# EAGLE design maplemini (EAGLE 9.2.2)
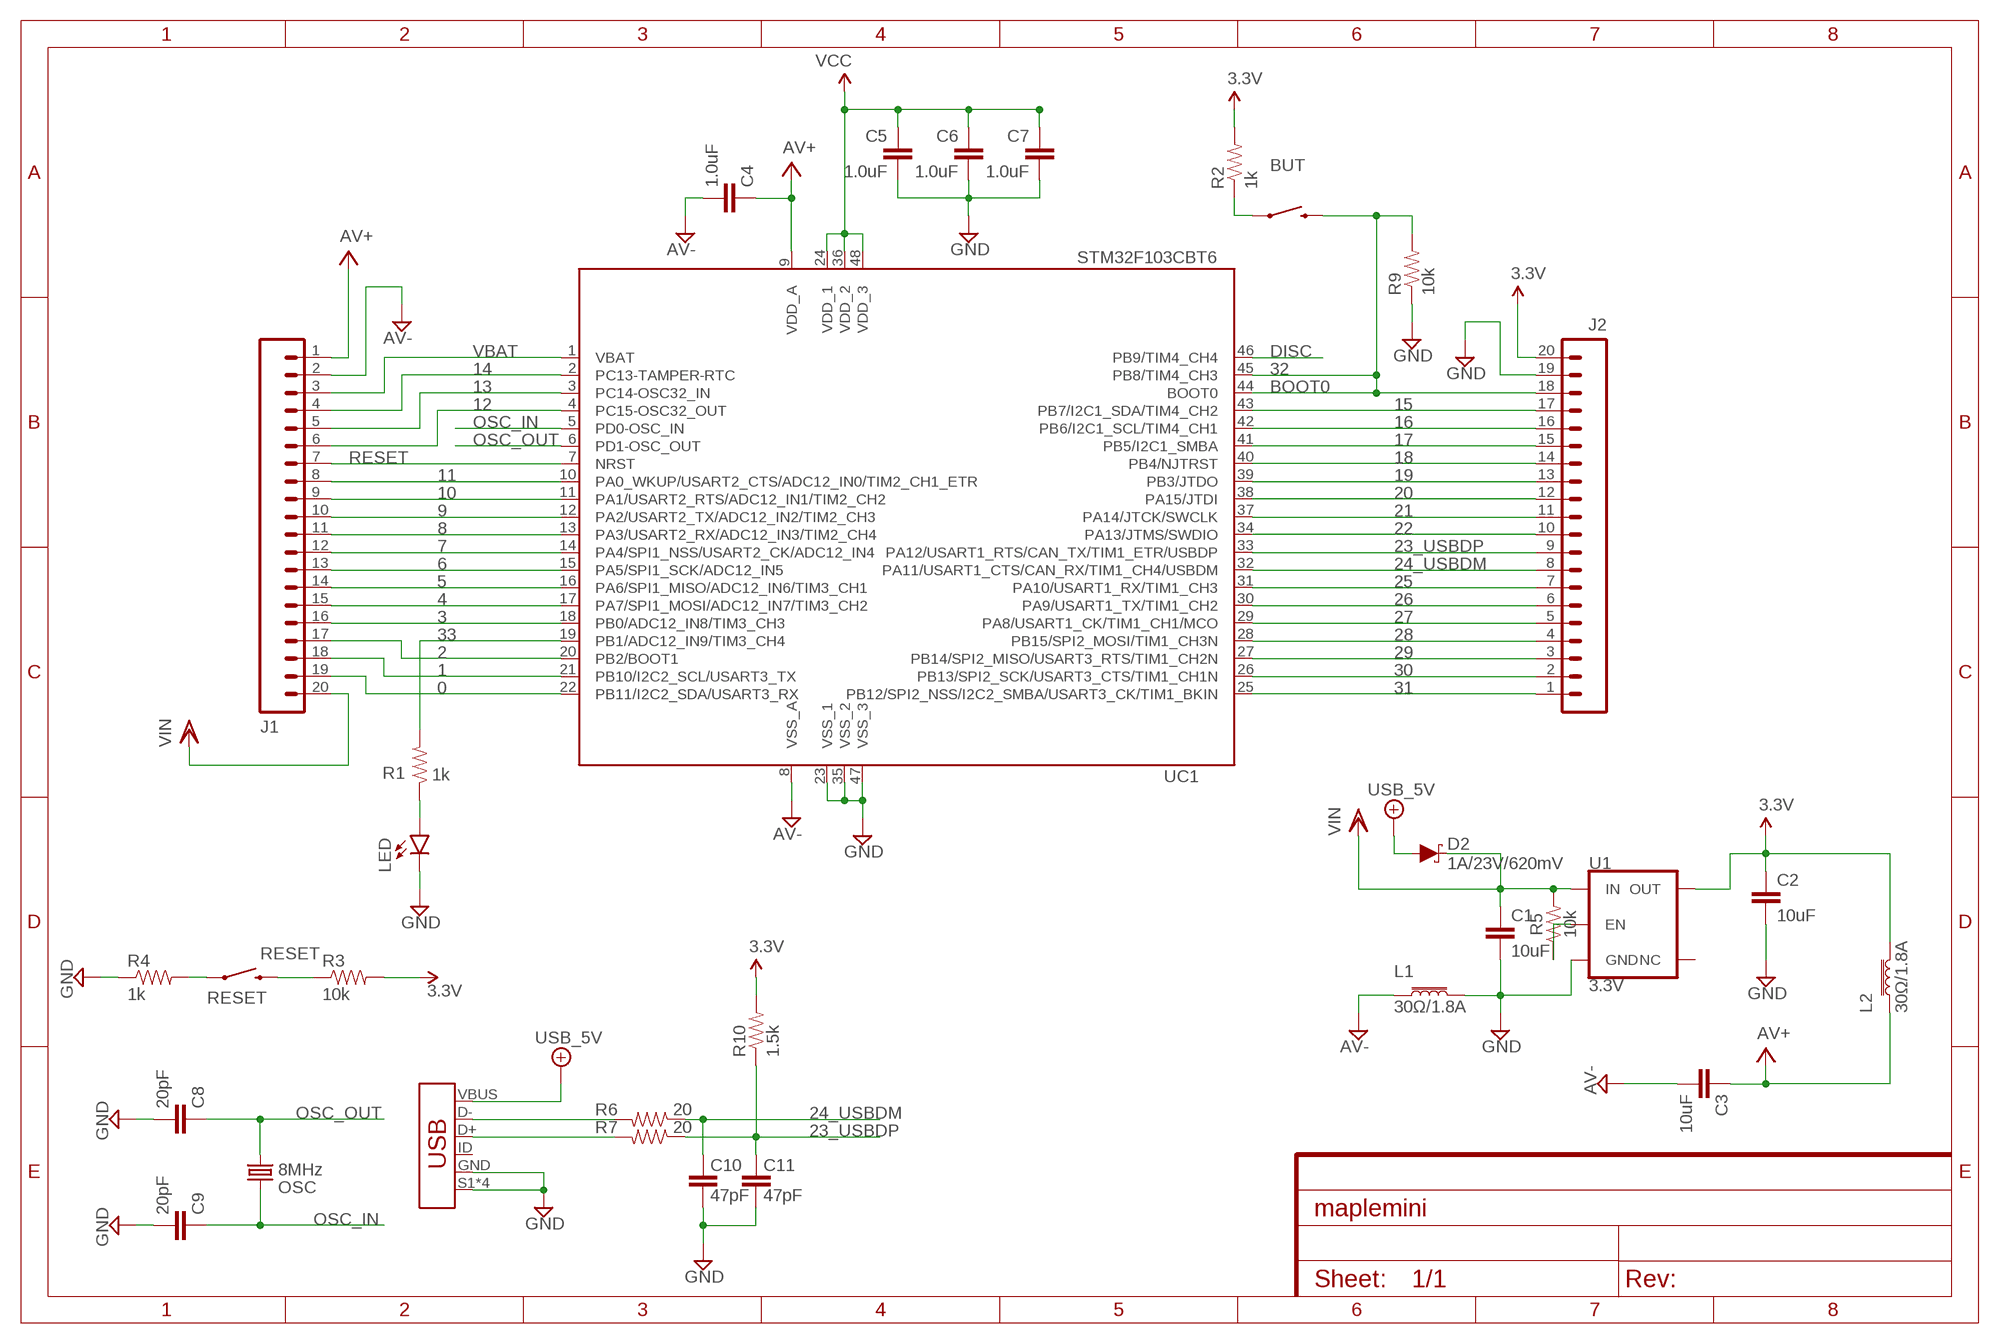
[diagram p0: schematic, sheet 1]

## Parts
BUT  KMR211GLFS  34-MOMENTARY-SWITCH  [3*4-MOMENTARY-SWITCH]
C1  10uF  10UF-0603-6.3V-20%  [0603]
C2  10uF  10UF-0603-6.3V-20%  [0603]
C3  10uF  10UF-0603-6.3V-20%  [0603]
C4  1.0uF  1.0UF-0603-16V-10%-X7R  [0603]
C5  1.0uF  1.0UF-0603-16V-10%-X7R  [0603]
C6  1.0uF  1.0UF-0603-16V-10%-X7R  [0603]
C7  1.0uF  1.0UF-0603-16V-10%-X7R  [0603]
C8  20pF  22PF-0603-50V-5%  [0603]
C9  20pF  22PF-0603-50V-5%  [0603]
C10  47pF  47PF-0603-50V-5%  [0603]
C11  47pF  47PF-0603-50V-5%  [0603]
D2  1A/23V/620mV  DIODE-SCHOTTKY-BAT20J  [SOD-323]
J1  CONN_20LOCK  [1X20_LOCK]
J2  CONN_20LOCK  [1X20_LOCK]
L1  30Ω/1.8A  FERRITE_BEAD-0603  [0603]
L2  30Ω/1.8A  FERRITE_BEAD-0603  [0603]
LED  RED  LED-RED1206  [LED-1206]
OSC  8MHz  CRYSTALSMD-5X3.2-2PAD  [CRYSTAL-SMD-5X3.2-2PAD]
R1  1k  1KOHM-0603-1/10W-1%  [0603]
R2  1k  1KOHM-0603-1/10W-1%  [0603]
R3  10k  10KOHM-0603-1/10W-1%  [0603]
R4  1k  1KOHM-0603-1/10W-1%  [0603]
R5  10k  10KOHM-0603-1/10W-1%  [0603]
R6  20  20OHM-0603-1/10W-1%  [0603]
R7  20  20OHM-0603-1/10W-1%  [0603]
R9  10k  10KOHM-0603-1/10W-1%  [0603]
R10  1.5k  1.5KOHM-0603-1/10W-1%  [0603]
RESET  KMR211GLFS  34-MOMENTARY-SWITCH  [3*4-MOMENTARY-SWITCH]
U1  3.3V  V_REG_AP2112K-3.3V  [SOT23-5]
UC1  STM32F103CBT6  STM32F103CB  [LQFP48]
X1  USB-MINIB  USB_MINI-B_SMT  [USB-MINIB]

## Nets
0: J1.19 UC1.22(PB11/I2C2_SDA/USART3_RX)
1: J1.18 UC1.21(PB10/I2C2_SCL/USART3_TX)
2: J1.17 UC1.20(PB2/BOOT1)
3: J1.16 UC1.18(PB0/ADC12_IN8/TIM3_CH3)
4: J1.15 UC1.17(PA7/SPI1_MOSI/ADC12_IN7/TIM3_CH2)
5: J1.14 UC1.16(PA6/SPI1_MISO/ADC12_IN6/TIM3_CH1)
6: J1.13 UC1.15(PA5/SPI1_SCK/ADC12_IN5)
7: J1.12 UC1.14(PA4/SPI1_NSS/USART2_CK/ADC12_IN4)
8: J1.11 UC1.13(PA3/USART2_RX/ADC12_IN3/TIM2_CH4)
9: J1.10 UC1.12(PA2/USART2_TX/ADC12_IN2/TIM2_CH3)
10: J1.9 UC1.11(PA1/USART2_RTS/ADC12_IN1/TIM2_CH2)
11: J1.8 UC1.10(PA0_WKUP/USART2_CTS/ADC12_IN0/TIM2_CH1_ETR)
12: J1.6 UC1.4(PC15-OSC32_OUT)
13: J1.5 UC1.3(PC14-OSC32_IN)
14: J1.4 UC1.2(PC13-TAMPER-RTC)
15: J2.17 UC1.43(PB7/I2C1_SDA/TIM4_CH2)
16: J2.16 UC1.42(PB6/I2C1_SCL/TIM4_CH1)
17: J2.15 UC1.41(PB5/I2C1_SMBA)
18: J2.14 UC1.40(PB4/NJTRST)
19: J2.13 UC1.39(PB3/JTDO)
20: J2.12 UC1.38(PA15/JTDI)
21: J2.11 UC1.37(PA14/JTCK/SWCLK)
22: J2.10 UC1.34(PA13/JTMS/SWDIO)
23_USBDP: C11.2 J2.9 R7.1 R10.1 UC1.33(PA12/USART1_RTS/CAN_TX/TIM1_ETR/USBDP)
24_USBDM: C10.2 J2.8 R6.1 UC1.32(PA11/USART1_CTS/CAN_RX/TIM1_CH4/USBDM)
25: J2.7 UC1.31(PA10/USART1_RX/TIM1_CH3)
26: J2.6 UC1.30(PA9/USART1_TX/TIM1_CH2)
27: J2.5 UC1.29(PA8/USART1_CK/TIM1_CH1/MCO)
28: J2.4 UC1.28(PB15/SPI2_MOSI/TIM1_CH3N)
29: J2.3 UC1.27(PB14/SPI2_MISO/USART3_RTS/TIM1_CH2N)
30: J2.2 UC1.26(PB13/SPI2_SCK/USART3_CTS/TIM1_CH1N)
31: J2.1 UC1.25(PB12/SPI2_NSS/I2C2_SMBA/USART3_CK/TIM1_BKIN)
32: BUT.P2 J2.18 R9.2 UC1.44(BOOT0) UC1.45(PB8/TIM4_CH3)
33: R1.2 UC1.19(PB1/ADC12_IN9/TIM3_CH4)
+5V/2: D2.A X1.VBUS ; supply symbol labelled USB_5V
AV+: C3.1 C4.1 J1.1 L2.1 UC1.9(VDD_A)
AV-: C3.2 C4.2 J1.2 L1.1 UC1.8(VSS_A)
DGND: C1.2 C2.2 C5.2 C6.2 C7.2 C8.2 C9.2 C10.1 C11.1 J2.19 L1.2 LED.C R4.1 R9.1 U1.2(GND) UC1.23(VSS_1) UC1.35(VSS_2) UC1.47(VSS_3) X1.GND X1.S1(SHIELD) X1.S2(SHIELD) X1.S3(SHIELD) X1.S4(SHIELD) ; supply symbol labelled GND
DISC: UC1.46(PB9/TIM4_CH4)
N$1: BUT.P1 R2.1
N$2: LED.A R1.1
N$3: R5.1 U1.3(EN)
N$4: R4.2 RESET.P1
N$59: R6.2 X1.D-
N$60: R7.2 X1.D+
OSC_IN: C9.1 OSC.P$2 UC1.5(PD0-OSC_IN)
OSC_OUT: C8.1 OSC.P$1 UC1.6(PD1-OSC_OUT)
RESET: J1.7 R3.1 RESET.P2 UC1.7(NRST)
VBAT: J1.3 UC1.1(VBAT)
VCC: C2.1 C5.1 C6.1 C7.1 J2.20 L2.2 R2.2 R3.2 R10.2 U1.5(OUT) UC1.24(VDD_1) UC1.36(VDD_2) UC1.48(VDD_3) ; supply symbol labelled 3.3V
VIN: C1.1 D2.C J1.20 R5.2 U1.1(IN)
Unconnected: U1.4(NC) X1.ID

## Notes on the sheet
- BOOT0

## Library data of the parts
BUT RESET = JH:3*4-MOMENTARY-SWITCH
C1-C3 = SparkFun-Capacitors:10UF: 10.0µF ceramic capacitors A capacitor is a passive two-terminal electrical component used to store electrical energy temporarily in an electric field.; PROD_ID: CAP-11015
C4-C7 = SparkFun-Capacitors:1.0UF: 1µF ceramic capacitors A capacitor is a passive two-terminal electrical component used to store electrical energy temporarily in an electric field.; PROD_ID: CAP-13930
C8 C9 = SparkFun-Capacitors:22PF: 22pF ceramic capacitors A capacitor is a passive two-terminal electrical component used to store electrical energy temporarily in an electric field.; PROD_ID: CAP-07876; VALUE: 22pF
C10 C11 = SparkFun-Capacitors:47PF: 47pF ceramic capacitors A capacitor is a passive two-terminal electrical component used to store electrical energy temporarily in an electric field.; PROD_ID: CAP-08913
D2 = SparkFun-DiscreteSemi:DIODE-SCHOTTKY: Schottky diode A Schottky diode is a semiconductor diode which has a low forward voltage drop and a very fast switching action.; PROD_ID: DIO-11623
J1 J2 = SparkFun-Connectors:CONN_20: Multi connection point. Often used as Generic Header-pin footprint for 0.1 inch spaced/style header connections On any of the 0.1 inch spaced packages, you can populate with these: Break Away Headers - Straight <https://www.sparkfun.com/products/116> (PRT-00116) Break Away Male Headers - Right Angle <https://www.sparkfun.com/products/553> (PRT-00553) Female Headers <https://www.sparkfun.com/products/115> (PRT-00115) Break Away Headers - Machine Pin <https://www.sparkfun.com/products/117> (PRT-00117) Break Away Female Headers - Swiss Machine Pin <https://www.sparkfun.com/products/743> (PRT-00743) For SCREWTERMINALS and SPRING TERMINALS visit here: Screw Terimnals on SparkFun.com <https://www.sparkfun.com/search/results?term=Screw+Terminals> (5mm/3.5mm/2.54mm spacing) This device is also useful as a general connection point to wire up your design to another part of your project. Our various solder wires solder well into these plated through hole pads. Hook-Up Wire - Assortment (Stranded, 22 AWG) <https://www.sparkfun.com/products/11375> (PRT-11375) Hook-Up Wire - Assortment (Solid Core, 22 AWG) <https://www.sparkfun.com/products/11367> (PRT-11367) View the entire wire category on our website here <https://www.sparkfun.com/categories/141> Special notes: Molex polarized connector foot print use with SKU : PRT-08231 with associated crimp pins and housings. 1MM SMD Version SKU: PRT-10208 NOTES ON THE VARIANTS LOCK and LOCK_LONGPADS... This footprint was designed to help hold the alignment of a through-hole component (i.e. 6-pin header) while soldering it into place. You may notice that each hole has been shifted either up or down by 0.005 of an inch from it's more standard position (which is a perfectly straight line). This slight alteration caused the pins (the squares in the middle) to touch the edges of the holes. Because they are alternating, it causes a "brace" to hold the component in place. 0.005 has proven to be the perfect amount of "off-center" position when using our standard breakaway headers. Although looks a little odd when you look at the bare footprint, once you have a header in there, the alteration is very hard to notice. Also,if you push a header all the way into place, it is covered up entirely on the bottom side. Note about LOCK SPECIAL package: This is just like the LOCK variant in that the holes are staggared by 5 mil, but except for the last two holes. They are not altered from the "standard" footprint layout. This is used for a special purpose on the layout of our Graphic LCD Backpack. Make sure you want to use this device before selecting it for you project!
L1 L2 = SparkFun-Coils:FERRITE_BEAD: Ferrite Bead (blocks, cores, rings, chokes, etc.) Inductor with layers of ferrite used to suppress high frequencies. Often used to isolate high frequency noise. SparkFun Products: IOIO-OTG - V2.2 <https://www.sparkfun.com/products/13613> SparkFun SAMD21 Mini Breakout <https://www.sparkfun.com/products/13664> SparkFun 6 Degrees of Freedom Breakout - LSM6DS3 <https://www.sparkfun.com/products/13339> SparkFun SAMD21 Dev Breakout <https://www.sparkfun.com/products/13672>; PROD_ID: NDUC-13805
LED = SparkFun-LED:LED-RED: Red SMD LED Used in manufacturing of most products at SparkFun Packages: 0603 - SMD 0603 package [Product Link] <http://docs.avagotech.com/docs/AV02-0551EN> 0603 SMART - SMD 0603 SMART package ( more efficient and expensive)[Product Link] <http://www.osram-os.com/Graphics/XPic2/00077099_0.pdf> 1206 - SMD1206 package [Product Link] <https://www.sparkfun.com/datasheets/DevTools/LilyPad/Q150OVS4.pdff> SparkFun Products: Pro Mini 328 -5V <https://www.sparkfun.com/products/821> RedBoard <https://www.sparkfun.com/products/12757> IOIO-OTG <https://www.sparkfun.com/products/13613>; PROD_ID: DIO-09912
OSC = SparkFun-Clocks:CRYSTAL: Crystals (Generic) These are passive quartz crystals, which can be used as a clock source for a microcontroller. Crystal's are two-terminal devices. They require external "load" capacitors to generate an oscillating signal.
R1 R2 R4 = SparkFun-Resistors:1KOHM: 1kΩ resistor A resistor is a passive two-terminal electrical component that implements electrical resistance as a circuit element. Resistors act to reduce current flow, and, at the same time, act to lower voltage levels within circuits. - Wikipedia; PROD_ID: RES-07856
R3 R5 R9 = SparkFun-Resistors:10KOHM: 10kΩ resistor A resistor is a passive two-terminal electrical component that implements electrical resistance as a circuit element. Resistors act to reduce current flow, and, at the same time, act to lower voltage levels within circuits. - Wikipedia; PROD_ID: RES-00824
R6 R7 = SparkFun-Resistors:20OHM: RES-07862; PROD_ID: RES-07862
R10 = SparkFun-Resistors:1.5KOHM: 1.5kΩ resistor A resistor is a passive two-terminal electrical component that implements electrical resistance as a circuit element. Resistors act to reduce current flow, and, at the same time, act to lower voltage levels within circuits. - Wikipedia; PROD_ID: RES-08306
U1 = SparkFun-IC-Power:V_REG_AP2112: AP2112 - 600mA CMOS LDO Regulator w/ Enable The AP2112 is CMOS process low dropout linear regulator with enable function, the regulator delivers a guaranteed 600mA (min.) continuous load current. Features Output Voltage Accuracy: ±1.5% Output Current: 600mA (Min.) Foldback Short Current Protection: 50mA Enable Function to Turn ON/OFF VOUT Low Dropout Voltage (3.3V): 250mV (Typ.) @IOUT=600mA Excellent Load Regulation: 0.2%/A (Typ.) Excellent Line Regulation: 0.02%/V (Typ.) Low Quiescent Current: 55μA (Typ.) Low Standby Current: 0.01μA (Typ.) Low Output Noise: 50μVRMS PSRR: 100Hz -65dB, 1kHz -65dB OTSD Protection Stable with 1.0μF Flexible Cap: Ceramic, Tantalum and Aluminum Electrolytic Operation Temperature Range: -40°C to 85°C ESD: MM 400V, HBM 4000V; PROD_ID: VREG-12457
UC1 = stm32:STM32F103CB
X1 = SparkFun-Connectors:USB_MINI-B: USB type Mini-B Connector Breaks out 5th pin, and includes shield pins if needed. SparkFun Products: SparkFun FTDI Basic Breakout <https://www.sparkfun.com/products/9716> SparkFun XBee Explorer USB <https://www.sparkfun.com/products/11812> SparkFun Redboard <https://www.sparkfun.com/products/12757>; PROD_ID: CONN-08193; SF_ID: PRT-00587

## Net classes
1 vcc: width 0.254 mm

## Board
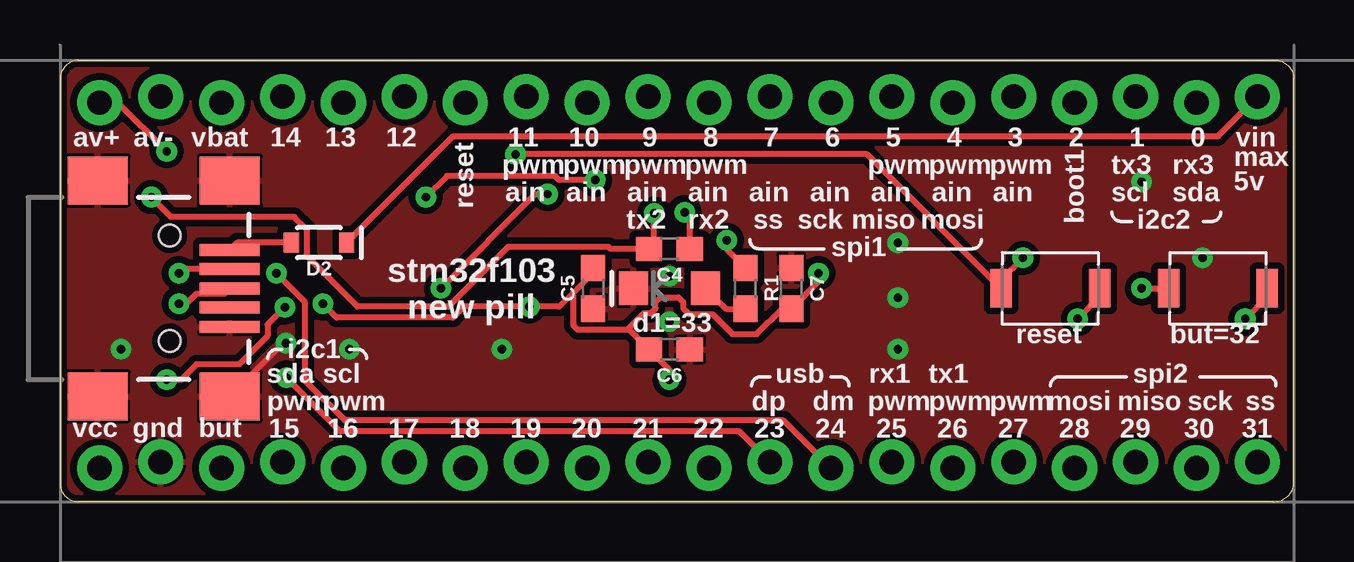
[diagram p1: board, top side]
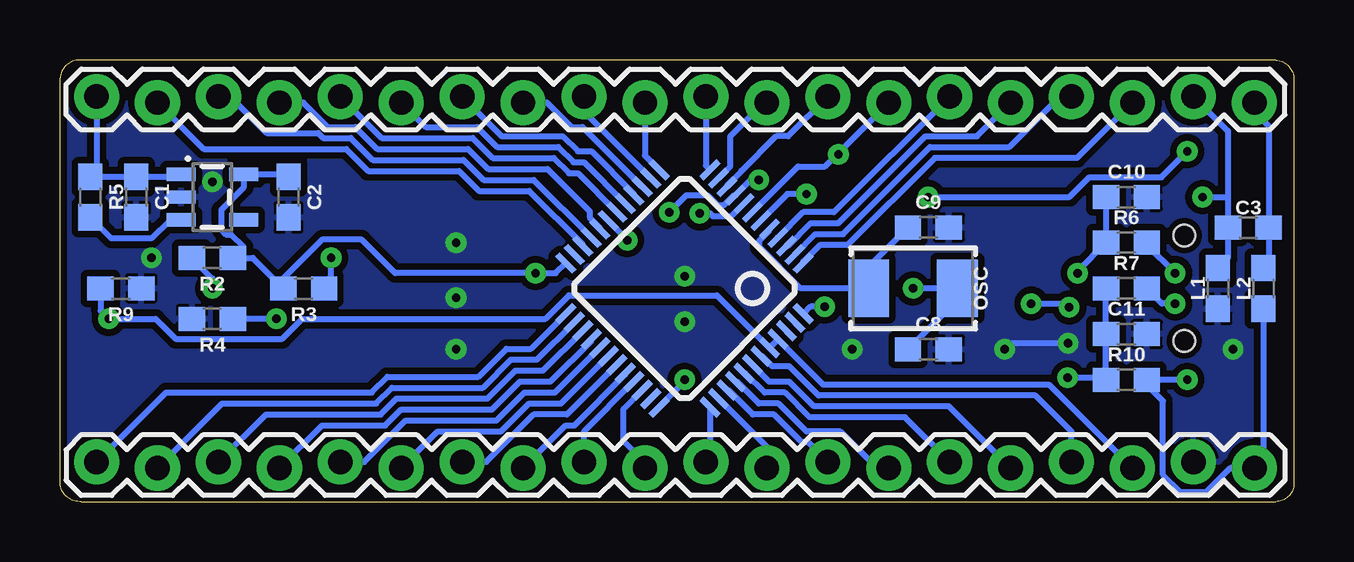
[diagram p2: board, bottom side, seen from below]

Size 51.44 x 18.42 mm. Coordinates in mm from the lower left corner, seen from the top.
Outline: 0.76,18.42 50.55,18.42 arc-90 51.44,17.66 51.44,0.76 arc-90 50.55,0 0.76,0 arc-90 0,0.76 0,17.53 arc-90 0.76,18.42
Copper layers (1*16): Top 0.035mm / dielectric 1.5mm / Bottom 0.035mm
Design rules "mine *": minimum track width 10mil, minimum drill 10mil, track to track 8mil, track to pad 8mil, pad to pad 8mil, via to via 8mil, smd to smd 8mil, copper to edge 8mil, drill to drill 8mil, minimum pad ring 12mil, minimum via ring 10mil, stop-mask expansion 4mil, vias tented up to drill 25mil, thermal gap 5mil

### Footprints (pad centres in the part's own frame; a part is rotated, then mirrored left to right if it is on the bottom)
3*4-MOMENTARY-SWITCH = smd 0.9 x 1.6: P1 -2.05,0; P2 2.05,0
0603 = smd 1.1 x 1: 1 -0.85,0; 2 0.85,0
SOD-323 = smd 0.63 x 0.83: A 1.15,0; C -1.15,0
1X20_LOCK = drill 1.016 pad 1.88: 1 0,0.127; 2 2.54,-0.127; 3 5.08,0.127; 4 7.62,-0.127; 5 10.16,0.127; 6 12.7,-0.127; 7 15.24,0.127; 8 17.78,-0.127; 9 20.32,0.127; 10 22.86,-0.127; 11 25.4,0.127; 12 27.94,-0.127; 13 30.48,0.127; 14 33.02,-0.127; 15 35.56,0.127; 16 38.1,-0.127; 17 40.64,0.127; 18 43.18,-0.127; 19 45.72,0.127; 20 48.26,-0.127
LED-1206 = smd 1.2 x 1.4: A -1.5,0; C 1.5,0
CRYSTAL-SMD-5X3.2-2PAD = smd 1.7 x 2.4: P$1 1.85,0; P$2 -1.85,0
SOT23-5 = smd 0.55 x 1.2: 1 -0.95,-1.3; 2 0,-1.3; 3 0.95,-1.3; 4 0.95,1.3; 5 -0.95,1.3
LQFP48 = smd 0.254 x 1: 1 -2.75,-4.25; 2 -2.25,-4.25; 3 -1.75,-4.25; 4 -1.25,-4.25; 5 -0.75,-4.25; 6 -0.25,-4.25; 7 0.25,-4.25; 8 0.75,-4.25; 9 1.25,-4.25; 10 1.75,-4.25; 11 2.25,-4.25; 12 2.75,-4.25; 25 2.75,4.25; 26 2.25,4.25; 27 1.75,4.25; 28 1.25,4.25; 29 0.75,4.25; 30 0.25,4.25; 31 -0.25,4.25; 32 -0.75,4.25; 33 -1.25,4.25; 34 -1.75,4.25; 35 -2.25,4.25; 36 -2.75,4.25 | smd 1 x 0.254: 13 4.25,-2.75; 14 4.25,-2.25; 15 4.25,-1.75; 16 4.25,-1.25; 17 4.25,-0.75; 18 4.25,-0.25; 19 4.25,0.25; 20 4.25,0.75; 21 4.25,1.25; 22 4.25,1.75; 23 4.25,2.25; 24 4.25,2.75; 37 -4.25,2.75; 38 -4.25,2.25; 39 -4.25,1.75; 40 -4.25,1.25; 41 -4.25,0.75; 42 -4.25,0.25; 43 -4.25,-0.25; 44 -4.25,-0.75; 45 -4.25,-1.25; 46 -4.25,-1.75; 47 -4.25,-2.25; 48 -4.25,-2.75
USB-MINIB = smd 2.5 x 0.5: D+ 2.5,0; D- 2.5,0.8; GND 2.5,-1.6; ID 2.5,-0.8; VBUS 2.5,1.6 | smd 2.5 x 2: S1 -3,4.5; S2 2.5,4.5; S3 -3,-4.5; S4 2.5,-4.5 | hole 0.9: 0,2.2; 0,-2.2

### Placement (x,y rotation side)
BUT  48.26,8.89 0 top
C1  48.26,12.7 270 bottom
C2  41.91,12.7 270 bottom
C3  1.91,11.43 180 bottom
C4  25.4,10.54 180 top
C5  22.23,8.89 270 top
C6  25.4,6.35 0 top
C7  30.48,8.89 90 top
C8  15.24,6.35 0 bottom
C9  15.24,11.43 0 bottom
C10  6.99,12.7 180 bottom
C11  6.99,6.99 180 bottom
D2  10.8,10.8 180 top
J1  1.65,16.77 180 bottom
J2  49.91,1.53 0 bottom
L1  3.18,8.89 270 bottom
L2  1.27,8.89 270 bottom
LED  25.4,8.89 180 top
OSC  15.88,8.89 0 bottom
R1  28.58,8.89 90 top
R2  45.09,10.16 0 bottom
R3  41.28,8.89 180 bottom
R4  45.09,7.62 0 bottom
R5  50.17,12.7 90 bottom
R6  6.99,10.8 0 bottom
R7  6.99,8.89 0 bottom
R9  48.9,8.89 180 bottom
R10  6.99,5.08 0 bottom
RESET  41.28,8.89 180 top
U1  45.09,12.7 270 bottom
UC1  25.4,8.89 135 bottom
X1  4.57,8.89 0 top

### Tracks (layer width: path | path; a pad name or v marks a point on that pad's centre or on a via)
0
  Bottom 0.254: J1.19 45.44,14.71 39.51,14.71 38.59,13.79 34.81,13.79 33.97,12.96 31.88,12.96 29.65,10.72 UC1.22
1
  Bottom 0.254: J1.18 44.34,16.89 42.82,15.37 40.67,15.37 40.47,15.17 39.32,15.17 38.41,14.25 34.62,14.25 33.78,13.41 31.69,13.41 UC1.21
2
  Bottom 0.254: UC1.20 28.94,11.43 29.36,11.85 29.36,12.11 31.12,13.87 33.59,13.87 34.43,14.71 38.22,14.71 39.13,15.62 40.28,15.62 41.3,16.64 J1.17
3
  Bottom 0.254: J1.16 38.03,15.17 34.24,15.17 33.4,14.33 30.86,14.33 30.23,13.69 29.85,13.69 UC1.18
4
  Bottom 0.254: J1.15 36.2,15.62 34.05,15.62 33.21,14.79 30.67,14.79 30.04,14.15 29.6,14.15 UC1.17
5
  Bottom 0.254: J1.14 33.02,15.24 30.48,15.24 29.85,14.61 29.29,14.61 27.52,12.84 UC1.16
6
  Bottom 0.254: UC1.15 29.66,15.62 30.12,15.62 31.14,16.64 J1.13
7
  Bottom 0.254: J1.12 29.59,16.27 UC1.14
8
  Bottom 0.254: J1.11 27.05,14.43 UC1.13
9
  Bottom 0.254: J1.10 24.51,14.01 UC1.12
10
  Bottom 0.254: UC1.11 23.5,13.98 23.5,15.24 22.1,16.64 J1.9
11
  Bottom 0.254: J1.8 21.08,15.24 21.59,15.24 23.04,13.79 23.63,13.2 UC1.10
12
  Bottom 0.254: J1.6 19.18,12.07 20.46,12.07 UC1.4
13
  Bottom 0.254: UC1.3 21.1,10.66 20.15,11.61 18.99,11.61 15.36,15.24 13.21,15.24 J1.5
14
  Bottom 0.254: UC1.2 19.96,11.15 18.8,11.15 15.17,14.79 11.87,14.79 9.76,16.89 J1.4
15
  Bottom 0.254: J2.17 9.27,2.92 10.78,4.43 19.82,4.43 21.03,5.64 21.74,5.64 22.16,6.06 UC1.43
16
  Bottom 0.254: J2.16 14.39,3.97 20.01,3.97 21.04,5 21.87,5 UC1.42
17
  Bottom 0.254: J2.15 16.22,3.52 20.2,3.52 21.23,4.55 22.06,4.55 22.87,5.36 | 22.87,5.36 | 22.87,5.36 UC1.41
18
  Bottom 0.254: J2.14 17.38,1.4 18.91,2.92 20.32,2.92 21.49,4.09 22.31,4.09 23.22,5 UC1.40
19
  Bottom 0.254: J2.13 20.25,2.47 20.51,2.47 21.68,3.63 22.56,3.63 23.57,4.65 UC1.39
20
  Bottom 0.254: J2.12 21.97,2.28 UC1.38
21
  Bottom 0.254: UC1.37 24.34,1.83 J2.11
22
  Bottom 0.254: J2.10 27.05,1.65 27.94,2.54 27.94,3.88 UC1.34
23_USBDP  (via drill 0.35)
  Top 0.254: J2.9 28.32,2.92 11.69,2.92 v9.44,5.17
  Bottom 0.254: R7.1 C11.2 R10.1 7.93,5.17 v9.44,5.17 | J2.9 29.59,2.93 UC1.33
24_USBDM  (via drill 0.35)
  Top 0.254: J2.8 30.15,3.38 11.88,3.38 10.19,5.06 10.19,8.35 v9.02,9.53
  Bottom 0.254: C10.2 R6.1 9.02,9.62 v9.02,9.53 | J2.8 30.36,3.18 30,3.18 27.88,5.3 UC1.32
25
  Bottom 0.254: UC1.31 30.31,3.63 31.69,3.63 33.68,1.65 J2.7
26
  Bottom 0.254: J2.6 35.69,2.92 33.05,2.92 31.88,4.09 30.56,4.09 UC1.30
27
  Bottom 0.254: J2.5 38.76,1.65 37.03,3.38 33.24,3.38 32.07,4.55 30.81,4.55 UC1.29
28
  Bottom 0.254: J2.4 40.52,3.18 37.88,3.18 37.22,3.84 33.43,3.84 32.26,5.01 31,5.01 29.29,6.71 UC1.28
29
  Bottom 0.254: J2.3 42.85,3.63 38.07,3.63 37.41,4.3 33.62,4.3 32.45,5.46 31.31,5.46 UC1.27
30
  Bottom 0.254: J2.2 44.68,4.09 38.26,4.09 37.6,4.75 33.81,4.75 32.64,5.92 31.56,5.92 UC1.26
31
  Bottom 0.254: J2.1 47.02,4.55 38.45,4.55 37.79,5.21 34,5.21 32.83,6.38 31.81,6.38 UC1.25
32  (via drill 0.35)
  Top 0.254: v49.41,7.62 50.31,8.53 BUT.P2
  Bottom 0.254: R9.2 49.75,7.96 v49.41,7.62 47.45,7.62 46.62,6.79 42.18,6.79 41.35,7.62 31.21,7.62 30.23,8.61 24.05,8.61 UC1.44 | UC1.44 | UC1.44 UC1.45 19.63,4.89 10.22,4.89 J2.18 | UC1.44
33  (via drill 0.35)
  Top 0.254: v27.8,10.91 27.8,10.52 R1.2
  Bottom 0.254: UC1.19 27.8,10.93 v27.8,10.91
+5V/2
  Top 0.254: D2.A 7.38,10.8 X1.VBUS
AV+  (via drill 0.35)
  Top 0.254: C4.1 26.25,11.85 v26.04,12.07 | v22.31,13.42 20.81,13.42 20.64,13.59 16.13,13.59 v15.24,12.7 | v4.45,14.61 2.42,16.64 J1.1
  Bottom 0.254: J1.1 1.65,16.26 1.06,15.66 C3.1 1.06,9.96 L2.1 | v26.04,12.07 25.32,12.78 24.46,12.78 24.04,12.36 23.76,12.36 23.34,12.78 UC1.9 22.65,13.42 v22.31,13.42 | v4.45,14.61 5.52,13.53 8.52,13.53 9.35,12.7 v15.24,12.7
AV-  (via drill 0.35)
  Top 0.254: v24.77,12.02 24.77,10.76 C4.2 22.94,10.54 22.86,10.62 18.68,10.62 16.19,8.13 12.41,8.13 10.29,10.25 10.29,11.35 9.77,11.87 4.64,11.87 v3.81,12.7
  Bottom 0.254: J1.2 2.76,15.46 2.76,12.7 | 2.76,12.7 C3.2 2.76,10.16 L1.1 | v24.77,12.02 24.34,12.02 24.22,11.9 23.45,11.9 UC1.8 | v3.81,12.7 2.76,12.7
DGND  (via drill 0.35)
  Top 0.254: X1.S4 9.29,6.61 v9.41,6.61
  Bottom 0.254: v9.41,6.61 11.81,6.61 v12.07,6.35
  other vias: 2.54,6.35 18.42,6.35 34.93,6.35 34.93,8.51 34.93,10.8 25.4,9.4 25.4,7.5 45.09,13.34 47.63,10.16
  pour Top (isolate 0.279): 0,18.42 51.44,18.42 51.44,0 0,0
  pour Bottom (isolate 0.279): 0,18.42 51.44,18.42 51.44,0 0,0
N$1  (via drill 0.35)
  Top 0.254: v45.09,8.89 BUT.P1
  Bottom 0.254: R2.1 45.09,9.31 v45.09,8.89
N$2
  Top 0.254: LED.A 27.75,8.04 R1.1
N$3
  Bottom 0.254: U1.3 46.85,11.75 47.63,10.97 49.29,10.97 R5.1
N$4  (via drill 0.35)
  Top 0.254: v42.42,7.62 43.33,8.53 RESET.P1
  Bottom 0.254: v42.42,7.62 R4.2
N$59  (via drill 0.35)
  Top 0.254: X1.D- 5.12,9.69 v4.96,9.53
  Bottom 0.254: v4.96,9.53 6.14,10.71 R6.2
N$60  (via drill 0.35)
  Top 0.254: X1.D+ 6.85,8.67 5.69,8.67 5.27,8.26 v4.96,8.26
  Bottom 0.254: v4.96,8.26 5.5,8.26 R7.2
OSC_IN
  Bottom 0.254: C9.1 17.73,9.8 OSC.P$2 20.57,8.89 22.29,10.61 22.29,10.89 21.87,11.31 UC1.5
OSC_OUT  (via drill 0.35)
  Top 0.254: v15.88,8.89 19.81,12.83 v20.32,12.83
  Bottom 0.254: C8.1 14.03,8.42 OSC.P$1 v15.88,8.89 | v20.32,12.83 21.11,12.83 UC1.6
RESET  (via drill 0.35)
  Top 0.254: v40.13,10.16 39.23,9.26 RESET.P2 33.64,14.48 v18.99,14.48
  Bottom 0.254: R3.1 40.13,9.19 v40.13,10.16 | UC1.7 20.68,13.97 19.56,13.97 18.99,14.54 | 18.99,14.54 J1.7 | v18.99,14.48 18.99,14.54
VBAT
  Bottom 0.254: J1.3 9.04,14.33 14.98,14.33 18.61,10.7 19.77,10.7 20.45,10.01 UC1.1
VCC  (via drill 0.35)
  Top 0.254: v25.4,5.08 25.4,5.5 C6.1 23.74,7.16 | 21.4,8.73 21.4,7.36 21.59,7.16 23.74,7.16 | 23.74,7.16 23.69,7.21 24.34,7.86 24.64,7.86 24.83,8.06 24.83,8.32 25.02,8.51 25.78,8.51 25.97,8.32 25.97,8.06 26.21,7.82 27.19,7.82 28.02,6.99 29.04,6.99 30.09,8.04 C7.1 31.61,9.17 v31.61,9.53 | C5.1 22.23,9.56 21.4,8.73 | 21.4,8.73 20.8,8.13 v19.56,8.13 16.84,8.13 16.38,7.68 11.53,7.68 v10.95,8.26 | v9.37,8.1 8.65,7.38 8.65,6.91 7.47,5.72 5.69,5.72 5.05,5.08 v4.45,5.08
  Bottom 0.254: L2.2 1.27,1.78 J2.20 2.65,1.4 3.67,0.38 4.72,0.38 5.46,1.13 5.46,4.19 6.14,4.87 | 6.14,4.87 R10.2 | C2.1 42.01,13.65 U1.5 43.79,13.09 44.72,12.16 44.72,11.34 44.52,11.15 44.32,11.15 43.79,10.61 R2.2 43.4,10.16 R3.2 42.13,9.31 40.52,10.92 38.86,10.92 37.47,9.53 v31.61,9.53 30.78,9.53 UC1.24 | UC1.36 25.4,5 v25.4,5.08 | v19.56,8.13 20.15,8.13 UC1.48 | v10.95,8.26 9.53,8.26 v9.37,8.1 | v4.45,5.08 5.92,5.08 6.14,4.87
VIN
  Top 0.254: D2.C 16.39,15.24 48.26,15.24 J1.20
  Bottom 0.254: J1.20 49.91,13.81 R5.2 C1.1 46.49,13.55 U1.1

### Text on the board
tPlace: av+ | av- | vbat | 14 | 13 | 12 | 11 | 10 | 9 | 8 | 7 | 6 | 5 | 4 | 3 | boot1 | 2 | 1 | 0 | vin | pwm | pwm | pwm | pwm | pwm | pwm | pwm | tx3 | rx3 | max | ain | ain | ain | ain | ain | ain | ain | ain | ain | scl | sda | 5v | reset | tx2 | rx2 | ss | sck | miso | mosi | i2c2 | spi1 | stm32f103 / new pill | d1=33 | reset | but=32 | i2c1 | sda | scl | usb | rx1 | tx1 | spi2 | pwm | pwm | dp | dm | pwm | pwm | pwm | mosi | miso | sck | ss | vcc | gnd | but | 15 | 16 | 17 | 18 | 19 | 20 | 21 | 22 | 23 | 24 | 25 | 26 | 27 | 28 | 29 | 30 | 31